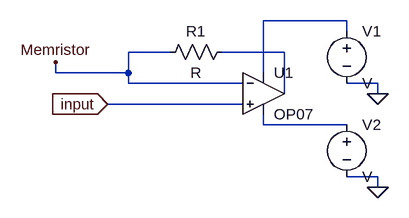
[diagram p0: schematic prog_block.asc]
prog_block.asc, the LTspice schematic file:
Version 4
SHEET 1 880 680
WIRE 272 0 144 0
WIRE 272 16 272 0
WIRE 0 48 -64 48
WIRE 176 48 80 48
WIRE -176 80 -176 64
WIRE -64 80 -64 48
WIRE -64 80 -176 80
WIRE 144 80 144 0
WIRE -64 96 -64 80
WIRE 112 96 -64 96
WIRE 320 96 272 96
WIRE 176 112 176 48
WIRE 320 112 320 96
WIRE 112 128 -96 128
WIRE 144 160 144 144
WIRE 272 160 144 160
WIRE 320 240 272 240
WIRE 320 256 320 240
FLAG 320 112 0
FLAG 320 256 0
FLAG -176 64 Memristor
FLAG -96 128 input
IOPIN -96 128 In
SYMBOL Opamps\\OP07 144 48 R0
SYMATTR InstName U1
SYMBOL voltage 272 0 R0
SYMATTR InstName V1
SYMBOL voltage 272 144 R0
SYMATTR InstName V2
SYMBOL res 96 32 R90
WINDOW 0 0 56 VBottom 2
WINDOW 3 32 56 VTop 2
SYMATTR InstName R1

The netlist it stands for:
* prog_block.asc
XU1 input Memristor N001 N003 N002 LT1001  ; OP07, pins In+ In- V+ V- OUT
V1 N001 0 V
V2 N003 0 V
R1 N002 Memristor R
.lib LTC.lib
.backanno
.end